# EAGLE schematic logger (EAGLE 6.4)
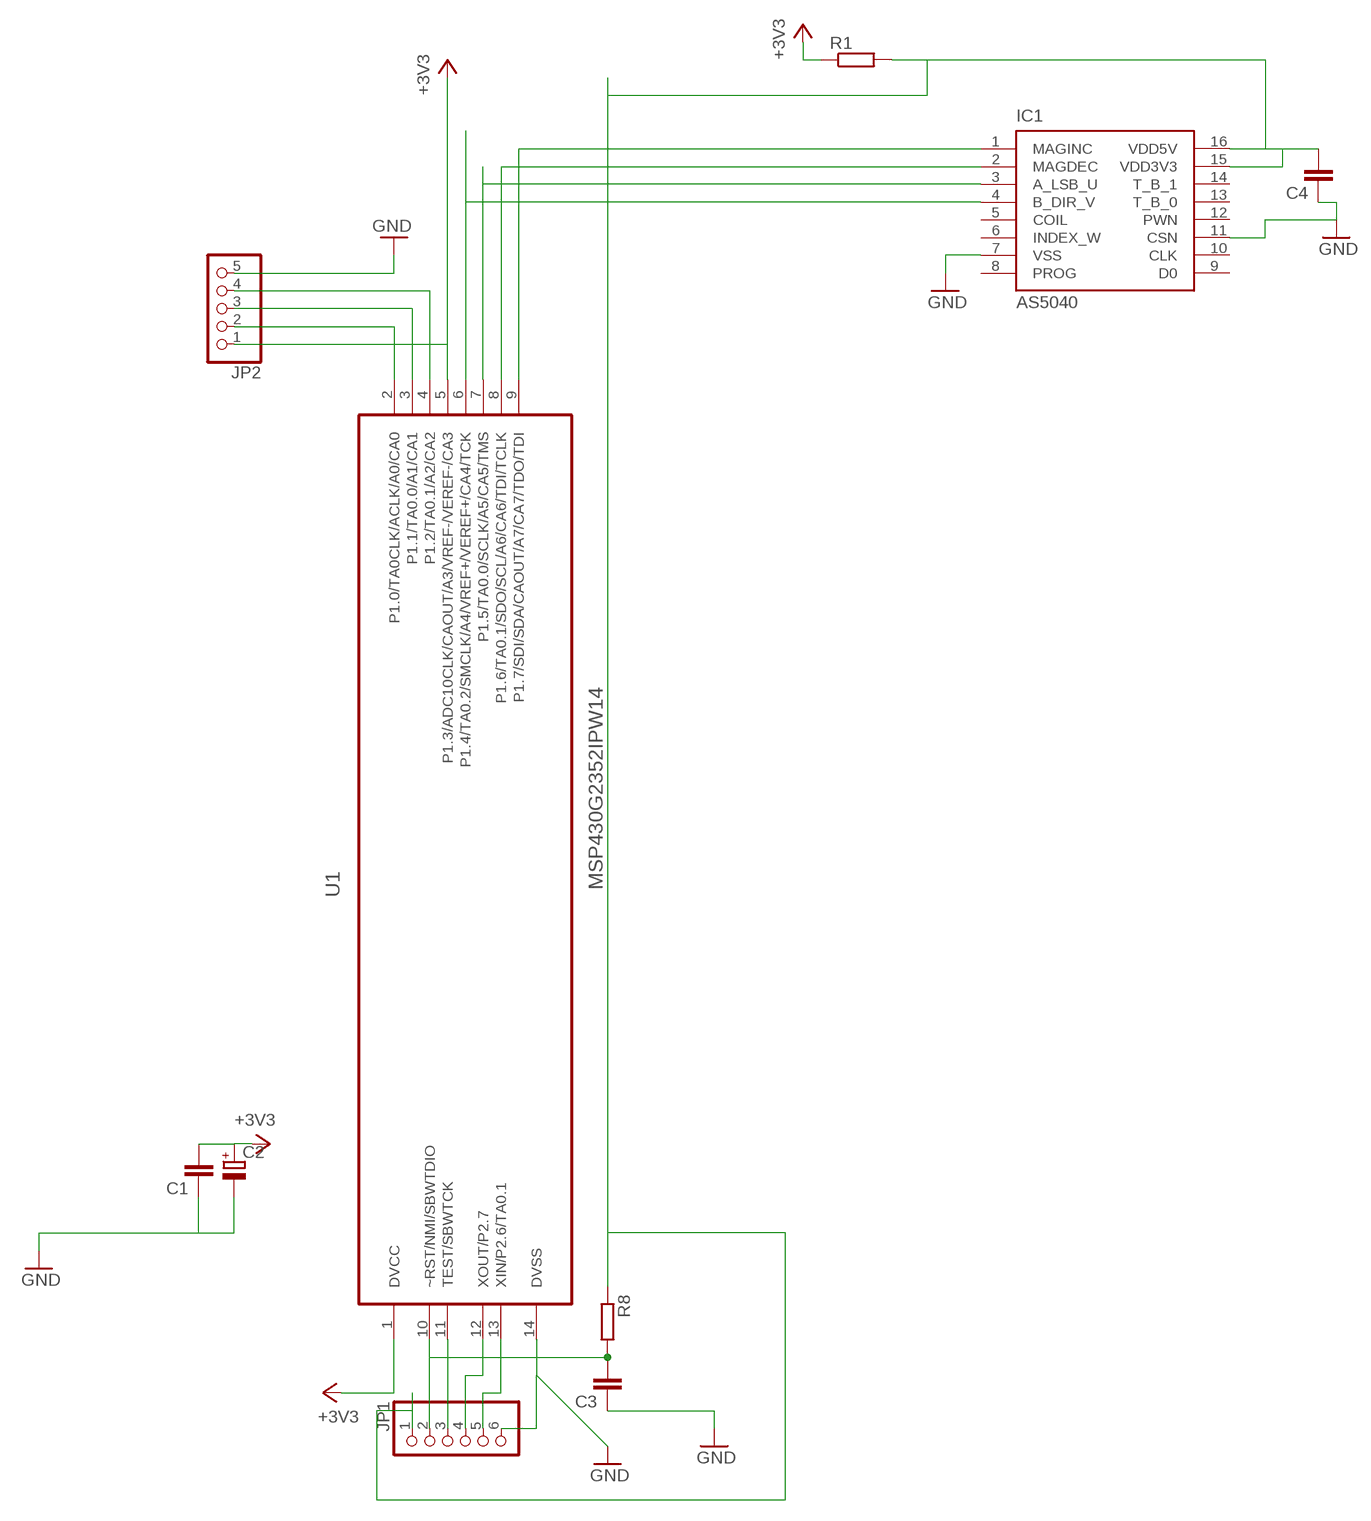
[diagram p0: schematic, sheet 1]

## Parts
C1  C-EUC0805  [C0805]
C2  CPOL-EUE2,5-6E  [E2,5-6E]
C3  C-EUC0805  [C0805]
C4  C-EUC0805  [C0805]
IC1  AS5040  [SSOP16]
JP1  PINHD-1X6/90  [1X06/90]
JP2  PINHD-1X5/90  [1X05/90]
R1  R-EU_R1206  [R1206]
R8  R-EU_R0805  [R0805]
U1  MSP430G2352IPW14  [SOP65P640X120-14N]

## Nets
+3V3: C1.2 C2.+ JP2.1 R1.1 U1.1(DVCC) U1.5(P1.3/ADC10CLK/CAOUT/A3/VREF-/VEREF-/CA3)
GND: C1.1 C2.- C3.1 C4.1 IC1.7(VSS) IC1.11(CSN) JP1.6 JP2.5 U1.14(DVSS)
N$1: JP1.3 U1.11(TEST/SBWTCK)
N$2: JP2.3 U1.3(P1.1/TA0.0/A1/CA1)
N$3: JP1.4 U1.12(XOUT/P2.7)
N$4: IC1.4(B_DIR_V) U1.6(P1.4/TA0.2/SMCLK/A4/VREF+/VEREF+/CA4/TCK)
N$5: IC1.3(A_LSB_U) U1.7(P1.5/TA0.0/SCLK/A5/CA5/TMS)
N$6: C4.2 IC1.15(VDD3V3) IC1.16(VDD5V) JP1.1 R1.2 R8.1
N$7: JP1.5 U1.13(XIN/P2.6/TA0.1)
N$10: IC1.2(MAGDEC) U1.8(P1.6/TA0.1/SDO/SCL/A6/CA6/TDI/TCLK)
N$11: IC1.1(MAGINC) U1.9(P1.7/SDI/SDA/CAOUT/A7/CA7/TDO/TDI)
N$13: JP2.2 U1.2(P1.0/TA0CLK/ACLK/A0/CA0)
N$15: C3.2 JP1.2 R8.2 U1.10(~RST/NMI/SBWTDIO)
N$17: JP2.4 U1.4(P1.2/TA0.1/A2/CA2)
Unconnected: IC1.5(COIL) IC1.6(INDEX_W) IC1.8(PROG) IC1.9(D0) IC1.10(CLK) IC1.12(PWN) IC1.13(T_B_0) IC1.14(T_B_1)

## Library data of the parts
C1 C3 C4 = rcl:C-EU: CAPACITOR, European symbol
C2 = rcl:CPOL-EU: POLARIZED CAPACITOR, European symbol
IC1 = austriamicrosystems:AS5040: 10-BIT PROGRAMMABLE MAGNETIC ROTARY ENCODER Source: www.austriamicrosystems.com .. AS5040DataSheetRev12.pdf; MPN: AS5040ASSU; OC_FARNELL: 1630800; OC_NEWARK: 59P4059
JP1 = pinhead:PINHD-1X6: PIN HEADER
JP2 = pinhead:PINHD-1X5: PIN HEADER
R1 R8 = rcl:R-EU_: RESISTOR, European symbol
U1 = MSP430G2352IPW14:MSP430G2352IPW14: MIXED SIGNAL MICROCONTROLLER; MPN: MSP430G2352IPW14; OC_FARNELL: 1866895; OC_NEWARK: 24T4701; PACKAGE: TSSOP-14; SUPPLIER: Texas Instruments